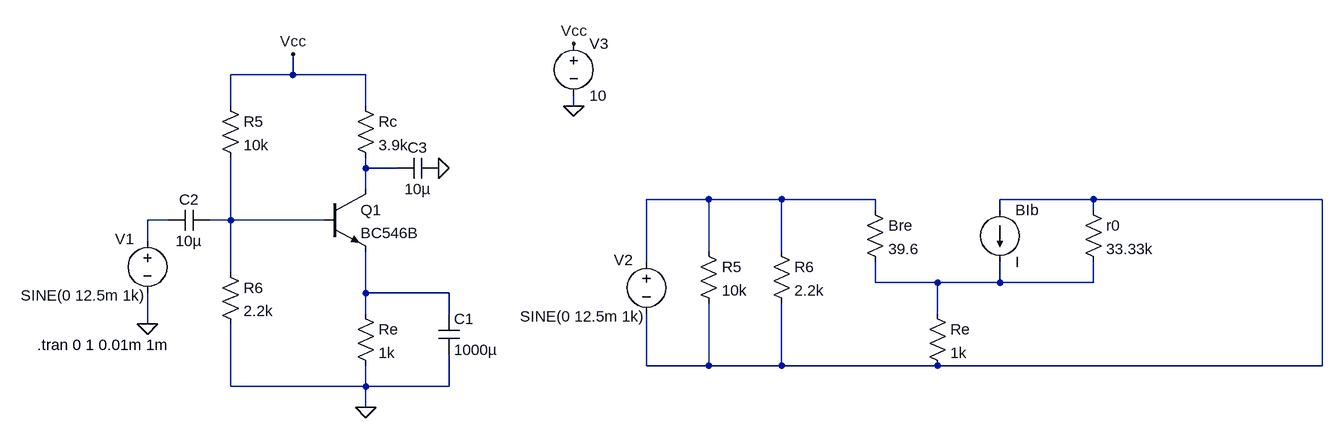
[diagram p0: schematic ProjectDraft1.asc]
ProjectDraft1.asc, the LTspice schematic file:
Version 4
SHEET 1 2072 680
WIRE 352 -192 352 -224
WIRE 352 -192 256 -192
WIRE 464 -192 352 -192
WIRE 256 -144 256 -192
WIRE 464 -144 464 -192
WIRE 784 -144 784 -160
WIRE 464 -48 464 -64
WIRE 512 -48 464 -48
WIRE 464 -16 464 -48
WIRE 992 0 896 0
WIRE 1104 0 992 0
WIRE 1248 0 1104 0
WIRE 1584 0 1440 0
WIRE 1936 0 1584 0
WIRE 1248 16 1248 0
WIRE 1440 16 1440 0
WIRE 1584 16 1584 0
WIRE 160 32 128 32
WIRE 256 32 256 -64
WIRE 256 32 224 32
WIRE 400 32 256 32
WIRE 128 64 128 32
WIRE 992 80 992 0
WIRE 1104 80 1104 0
WIRE 896 96 896 0
WIRE 256 112 256 32
WIRE 1248 128 1248 96
WIRE 1344 128 1248 128
WIRE 1440 128 1440 96
WIRE 1440 128 1344 128
WIRE 1584 128 1584 96
WIRE 1584 128 1440 128
WIRE 464 144 464 80
WIRE 592 144 464 144
WIRE 464 176 464 144
WIRE 592 176 592 144
WIRE 1344 176 1344 128
WIRE 128 192 128 144
WIRE 896 256 896 176
WIRE 992 256 992 160
WIRE 992 256 896 256
WIRE 1104 256 1104 160
WIRE 1104 256 992 256
WIRE 1344 256 1104 256
WIRE 1936 256 1936 0
WIRE 1936 256 1344 256
WIRE 256 288 256 192
WIRE 464 288 464 256
WIRE 464 288 256 288
WIRE 592 288 592 240
WIRE 592 288 464 288
WIRE 464 320 464 288
FLAG 128 192 0
FLAG 464 320 0
FLAG 784 -144 0
FLAG 784 -240 Vcc
FLAG 352 -224 Vcc
FLAG 576 -48 0
SYMBOL voltage 128 48 R0
WINDOW 0 -50 13 Left 2
WINDOW 3 -195 100 Left 2
WINDOW 123 0 0 Left 2
WINDOW 39 0 0 Left 2
SYMATTR InstName V1
SYMATTR Value SINE(0 12.5m 1k)
SYMBOL npn 400 -16 R0
SYMATTR InstName Q1
SYMATTR Value BC546B
SYMBOL res 448 -160 R0
SYMATTR InstName Rc
SYMATTR Value 3.9k
SYMBOL res 448 160 R0
SYMATTR InstName Re
SYMATTR Value 1k
SYMBOL res 240 -160 R0
SYMATTR InstName R5
SYMATTR Value 10k
SYMBOL res 240 96 R0
SYMATTR InstName R6
SYMATTR Value 2.2k
SYMBOL cap 576 176 R0
SYMATTR InstName C1
SYMATTR Value 1000µ
SYMBOL cap 224 16 R90
WINDOW 0 0 32 VBottom 2
WINDOW 3 32 32 VTop 2
SYMATTR InstName C2
SYMATTR Value 10µ
SYMBOL cap 576 -64 R90
WINDOW 0 0 32 VBottom 2
WINDOW 3 32 32 VTop 2
SYMATTR InstName C3
SYMATTR Value 10µ
SYMBOL voltage 784 -256 R0
WINDOW 123 0 0 Left 2
WINDOW 39 0 0 Left 2
SYMATTR InstName V3
SYMATTR Value 10
SYMBOL res 1088 64 R0
SYMATTR InstName R6
SYMATTR Value 2.2k
SYMBOL res 976 64 R0
SYMATTR InstName R5
SYMATTR Value 10k
SYMBOL res 1232 0 R0
SYMATTR InstName Bre
SYMATTR Value 39.6
SYMBOL res 1328 160 R0
SYMATTR InstName Re
SYMATTR Value 1k
SYMBOL current 1440 16 R0
SYMATTR InstName BIb
SYMBOL res 1568 0 R0
SYMATTR InstName r0
SYMATTR Value 33.33k
SYMBOL voltage 896 80 R0
WINDOW 0 -50 13 Left 2
WINDOW 3 -195 100 Left 2
WINDOW 123 0 0 Left 2
WINDOW 39 0 0 Left 2
SYMATTR InstName V2
SYMATTR Value SINE(0 12.5m 1k)
TEXT -42 224 Left 2 !.tran 0 1 0.01m 1m

The netlist it stands for:
* ProjectDraft1.asc
V1 N004 0 SINE(0 12.5m 1k)
Q1 N001 N005 N007 0 BC546B
Rc Vcc N001 3.9k
Re N007 0 1k
R5 Vcc N005 10k
R6 N005 0 2.2k
C1 N007 0 1000µ
C2 N005 N004 10µ
C3 0 N001 10µ
V3 Vcc 0 10
R6 N002 N003 2.2k
R5 N002 N003 10k
R§Bre N002 N006 39.6
Re N006 N003 1k
I§BIb N003 N006 I
r0 N003 N006 33.33k
V2 N002 N003 SINE(0 12.5m 1k)
.model NPN NPN
.model PNP PNP
.lib standard.bjt
.tran 0 1 0.01m 1m
.backanno
.end